# EAGLE design i2c-level-converter (EAGLE 5.10)
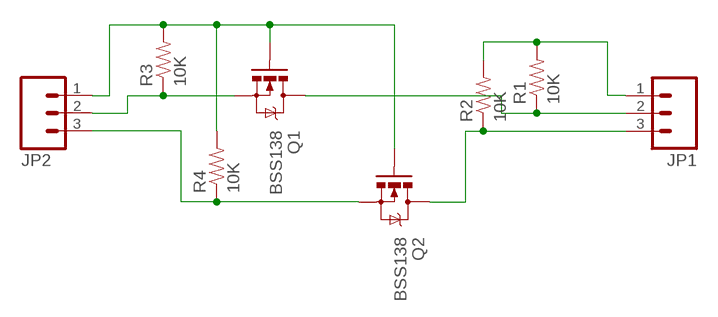
[diagram p0: schematic, sheet 1]

## Parts
JP1  M03LOCK_LONGPADS  [1X03_LOCK_LONGPADS]
JP2  M03LOCK_LONGPADS  [1X03_LOCK_LONGPADS]
Q1  BSS138  MOSFET-NCHANNELSMD  [SOT23-3]
Q2  BSS138  MOSFET-NCHANNELSMD  [SOT23-3]
R1  10K  RESISTORPTH1  [AXIAL-0.3]
R2  10K  RESISTORPTH1  [AXIAL-0.3]
R3  10K  RESISTORPTH1  [AXIAL-0.3]
R4  10K  RESISTORPTH1  [AXIAL-0.3]

## Nets
HV: JP1.1 R1.P$2 R2.P$2
LV: JP2.1 Q1.1(G) Q2.1(G) R3.P$2 R4.P$2
SCL1: JP2.3 Q2.2(S) R4.P$1
SCL2: JP1.3 Q2.3(D) R2.P$1
SDA1: JP2.2 Q1.2(S) R3.P$1
SDA2: JP1.2 Q1.3(D) R1.P$1

## Library data of the parts
JP1 JP2 = SparkFun:M03: Header 3 Standard 3-pin 0.1" header. Use with straight break away headers (SKU : PRT-00116), right angle break away headers (PRT-00553), swiss pins (PRT-00743), machine pins (PRT-00117), and female headers (PRT-00115). Molex polarized connector foot print use with SKU : PRT-08232 with associated crimp pins and housings.
Q1 Q2 = ideabot:MOSFET-NCHANNEL
R1-R4 = SparkFun:RESISTOR: Resistor Basic schematic elements and footprints for 0603, 1206, and PTH 1/10th watt (small) resistors.

## Board
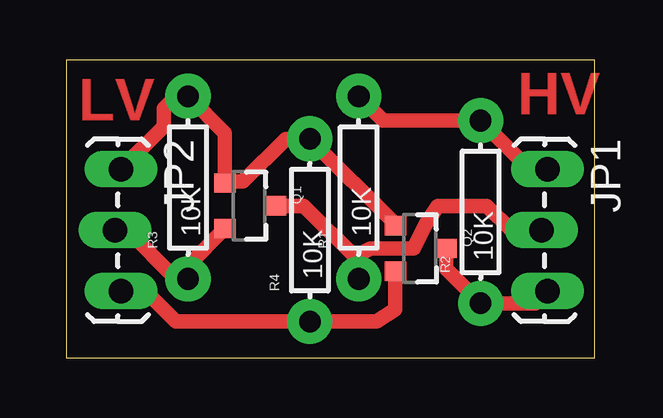
[diagram p1: board, top side]

Size 22.02 x 12.44 mm. Coordinates in mm from the lower left corner, seen from the top.
Outline: 0,0 22.02,0 22.02,12.44 0,12.44 0,0
Copper layers (1*16): Top 0.035mm / dielectric 1.5mm / Bottom 0.035mm
Design rules "default": minimum track width 10mil, minimum drill 24mil, track to track 8mil, track to pad 8mil, pad to pad 8mil, via to via 8mil, smd to smd 8mil, copper to edge 40mil, drill to drill 8mil, minimum pad ring 10mil, minimum via ring 8mil, stop-mask expansion 4mil, vias tented up to drill 0mil, thermal gap 10mil

### Footprints (pad centres in the part's own frame; a part is rotated, then mirrored left to right if it is on the bottom)
1X03_LOCK_LONGPADS = drill 1.016 long: 1 0,0; 2 2.54,-0.254; 3 5.08,0
SOT23-3 = smd 0.8 x 0.9: 1 -0.95,-1; 2 0.95,-1; 3 0,1.1
AXIAL-0.3 = drill 0.9 pad 1.88 round: P$1 -3.81,0; P$2 3.81,0

### Placement (x,y rotation side)
JP1  20.07,7.87 270 top
JP2  2.29,7.87 270 top
Q1  7.62,6.35 270 top
Q2  14.73,4.57 270 top
R1  12.19,7.11 90 top
R2  17.27,6.1 90 top
R3  5.08,7.11 90 top
R4  10.16,5.33 90 top

### Tracks (layer width: path | path; a pad name or v marks a point on that pad's centre or on a via)
HV
  Top 0.61: JP1.1 19.3,7.87 R2.P$2 13.21,9.91 R1.P$2
LV
  Top 0.61: Q2.1 13.73,5.57 R4.P$2 9.14,9.14 7.37,7.37 6.69,7.37 Q1.1 6.62,9.38 R3.P$2 4.57,10.92 4.06,10.41 4.06,9.65 JP2.1
SCL1
  Top 0.61: Q2.2 13.72,3.61 13.72,2.03 12.95,1.52 R4.P$1 4.57,1.52 3.3,2.79 JP2.3
SCL2
  Top 0.61: Q2.3 15.83,3.73 R2.P$1 19.56,2.29 JP1.3
SDA1
  Top 0.61: JP2.2 2.54,5.33 4.57,3.3 R3.P$1 5.08,3.86 Q1.2
SDA2
  Top 0.61: JP1.2 18.54,5.33 17.53,6.35 15.49,6.35 14.99,5.59 14.48,4.57 12.7,4.57 12.19,4.32 R1.P$1 12.19,4.06 9.91,6.35 Q1.3

### Text on the board
Top: LV | HV